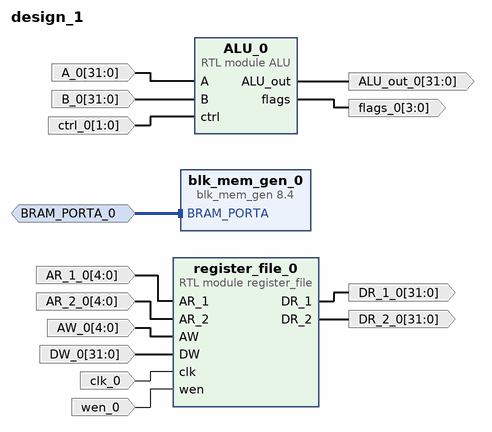
[diagram p0: block diagram of the top level]
# Vivado block design design_1, xck26-sfvc784-2LV-c, Vivado 2024.2
create_bd_design design_1

create_bd_intf_port -mode Slave -vlnv xilinx.com:interface:bram_rtl:1.0 BRAM_PORTA_0
create_bd_port -dir O -from 31 -to 0 DR_2_0
create_bd_port -dir O -from 31 -to 0 DR_1_0
create_bd_port -dir I -from 31 -to 0 DW_0
create_bd_port -dir I -from 4 -to 0 AW_0
create_bd_port -dir I -from 31 -to 0 A_0
create_bd_port -dir I -from 31 -to 0 B_0
create_bd_port -dir O -from 3 -to 0 flags_0
create_bd_port -dir O -from 31 -to 0 ALU_out_0
create_bd_port -dir I wen_0
create_bd_port -dir I -from 4 -to 0 AR_2_0
create_bd_port -dir I -type clk clk_0
create_bd_port -dir I -from 4 -to 0 AR_1_0
create_bd_port -dir I -from 1 -to 0 ctrl_0

create_bd_cell -type ip -vlnv xilinx.com:ip:blk_mem_gen:8.4 blk_mem_gen_0
set_property -dict [list \
  CONFIG.Enable_A Always_Enabled \
  CONFIG.Operating_Mode_A READ_FIRST \
  CONFIG.Register_PortA_Output_of_Memory_Primitives false \
  CONFIG.use_bram_block Stand_Alone \
] [get_bd_cells blk_mem_gen_0]
create_bd_cell -type module -reference ALU ALU_0
create_bd_cell -type module -reference register_file register_file_0

# ---- connections ----

connect_bd_intf_net -intf_net BRAM_PORTA_0_1 [get_bd_intf_ports BRAM_PORTA_0] [get_bd_intf_pins blk_mem_gen_0/BRAM_PORTA]
connect_bd_net [get_bd_pins ALU_0/ALU_out] [get_bd_ports ALU_out_0]
connect_bd_net [get_bd_pins ALU_0/flags] [get_bd_ports flags_0]
connect_bd_net -net AR_1_0_1 [get_bd_ports AR_1_0] [get_bd_pins register_file_0/AR_1]
connect_bd_net -net AR_2_0_1 [get_bd_ports AR_2_0] [get_bd_pins register_file_0/AR_2]
connect_bd_net -net AW_0_1 [get_bd_ports AW_0] [get_bd_pins register_file_0/AW]
connect_bd_net -net A_0_1 [get_bd_ports A_0] [get_bd_pins ALU_0/A]
connect_bd_net -net B_0_1 [get_bd_ports B_0] [get_bd_pins ALU_0/B]
connect_bd_net -net DW_0_1 [get_bd_ports DW_0] [get_bd_pins register_file_0/DW]
connect_bd_net -net clk_0_1 [get_bd_ports clk_0] [get_bd_pins register_file_0/clk]
connect_bd_net -net ctrl_0_1 [get_bd_ports ctrl_0] [get_bd_pins ALU_0/ctrl]
connect_bd_net [get_bd_pins register_file_0/DR_1] [get_bd_ports DR_1_0]
connect_bd_net [get_bd_pins register_file_0/DR_2] [get_bd_ports DR_2_0]
connect_bd_net -net wen_0_1 [get_bd_ports wen_0] [get_bd_pins register_file_0/wen]

validate_bd_design
save_bd_design
